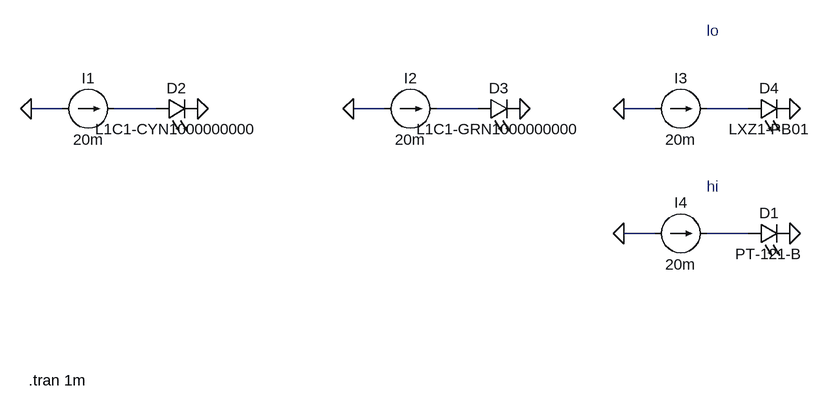
[diagram p0: schematic eqled.asc]
eqled.asc, the LTspice schematic file:
Version 4
SHEET 1 1272 680
WIRE 48 -176 0 -176
WIRE 192 -176 128 -176
WIRE 544 -176 496 -176
WIRE 688 -176 624 -176
WIRE 960 -176 912 -176
WIRE 1104 -176 1040 -176
WIRE 960 16 912 16
WIRE 1104 16 1040 16
FLAG 0 -176 0
FLAG 256 -176 0
FLAG 496 -176 0
FLAG 752 -176 0
FLAG 912 -176 0
FLAG 1168 -176 0
FLAG 912 16 0
FLAG 1168 16 0
SYMBOL current 48 -176 R270
WINDOW 0 32 40 VTop 2
WINDOW 3 -32 40 VBottom 2
WINDOW 123 0 0 Left 0
WINDOW 39 0 0 Left 0
SYMATTR InstName I1
SYMATTR Value 20m
SYMBOL LED 1104 32 R270
WINDOW 0 32 32 VTop 2
WINDOW 3 0 32 VBottom 2
SYMATTR InstName D1
SYMATTR Value PT-121-B
SYMATTR Description Diode
SYMATTR Type diode
SYMBOL LED 192 -160 R270
WINDOW 0 32 32 VTop 2
WINDOW 3 0 32 VBottom 2
SYMATTR InstName D2
SYMATTR Value L1C1-CYN1000000000
SYMATTR Description Diode
SYMATTR Type diode
SYMBOL LED 688 -160 R270
WINDOW 0 32 32 VTop 2
WINDOW 3 0 32 VBottom 2
SYMATTR InstName D3
SYMATTR Value L1C1-GRN1000000000
SYMATTR Description Diode
SYMATTR Type diode
SYMBOL LED 1104 -160 R270
WINDOW 0 32 32 VTop 2
WINDOW 3 0 32 VBottom 2
SYMATTR InstName D4
SYMATTR Value LXZ1-PB01
SYMATTR Description Diode
SYMATTR Type diode
SYMBOL current 544 -176 R270
WINDOW 0 32 40 VTop 2
WINDOW 3 -32 40 VBottom 2
WINDOW 123 0 0 Left 0
WINDOW 39 0 0 Left 0
SYMATTR InstName I2
SYMATTR Value 20m
SYMBOL current 960 -176 R270
WINDOW 0 32 40 VTop 2
WINDOW 3 -32 40 VBottom 2
WINDOW 123 0 0 Left 0
WINDOW 39 0 0 Left 0
SYMATTR InstName I3
SYMATTR Value 20m
SYMBOL current 960 16 R270
WINDOW 0 32 40 VTop 2
WINDOW 3 -32 40 VBottom 2
WINDOW 123 0 0 Left 0
WINDOW 39 0 0 Left 0
SYMATTR InstName I4
SYMATTR Value 20m
TEXT -4 242 Left 2 !.tran 1m
TEXT 1040 -296 Left 2 ;lo
TEXT 1040 -56 Left 2 ;hi

The netlist it stands for:
* eqled.asc
I1 0 N001 20m
D1 N004 0 PT-121-B
D2 N001 0 L1C1-CYN1000000000
D3 N002 0 L1C1-GRN1000000000
D4 N003 0 LXZ1-PB01
I2 0 N002 20m
I3 0 N003 20m
I4 0 N004 20m
.model D D
.lib standard.dio
.tran 1m
* lo
* hi
.backanno
.end